# EAGLE schematic TUTUPA V2.5sch (EAGLE 7.3.0)

## Sheet 1 of 2
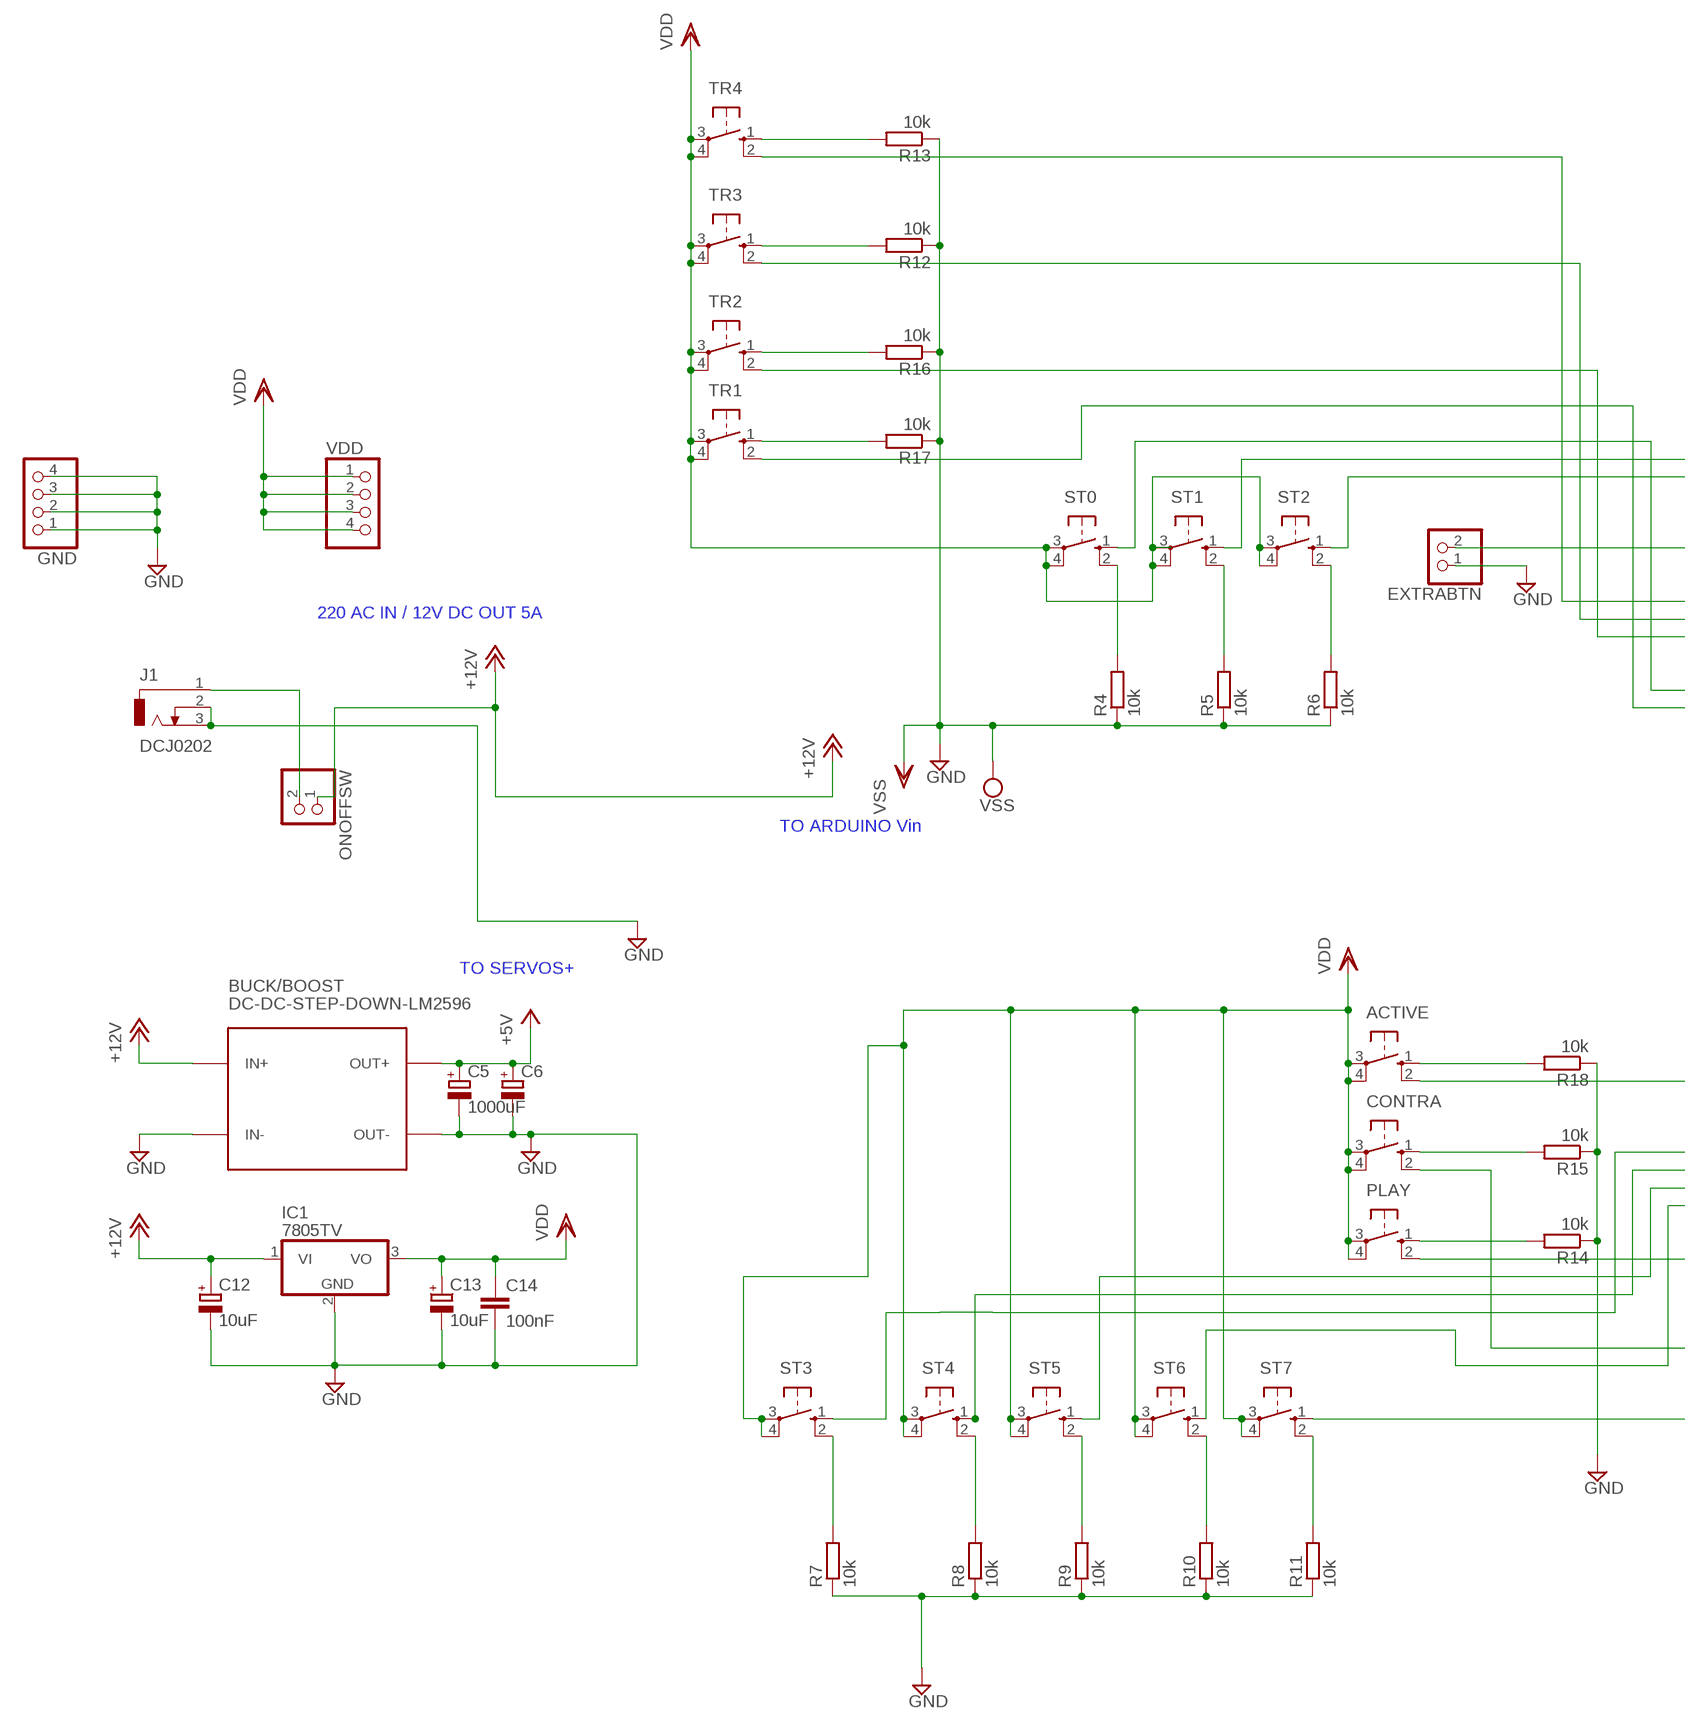
[diagram p0: schematic, sheet 1, part 1 of 2]
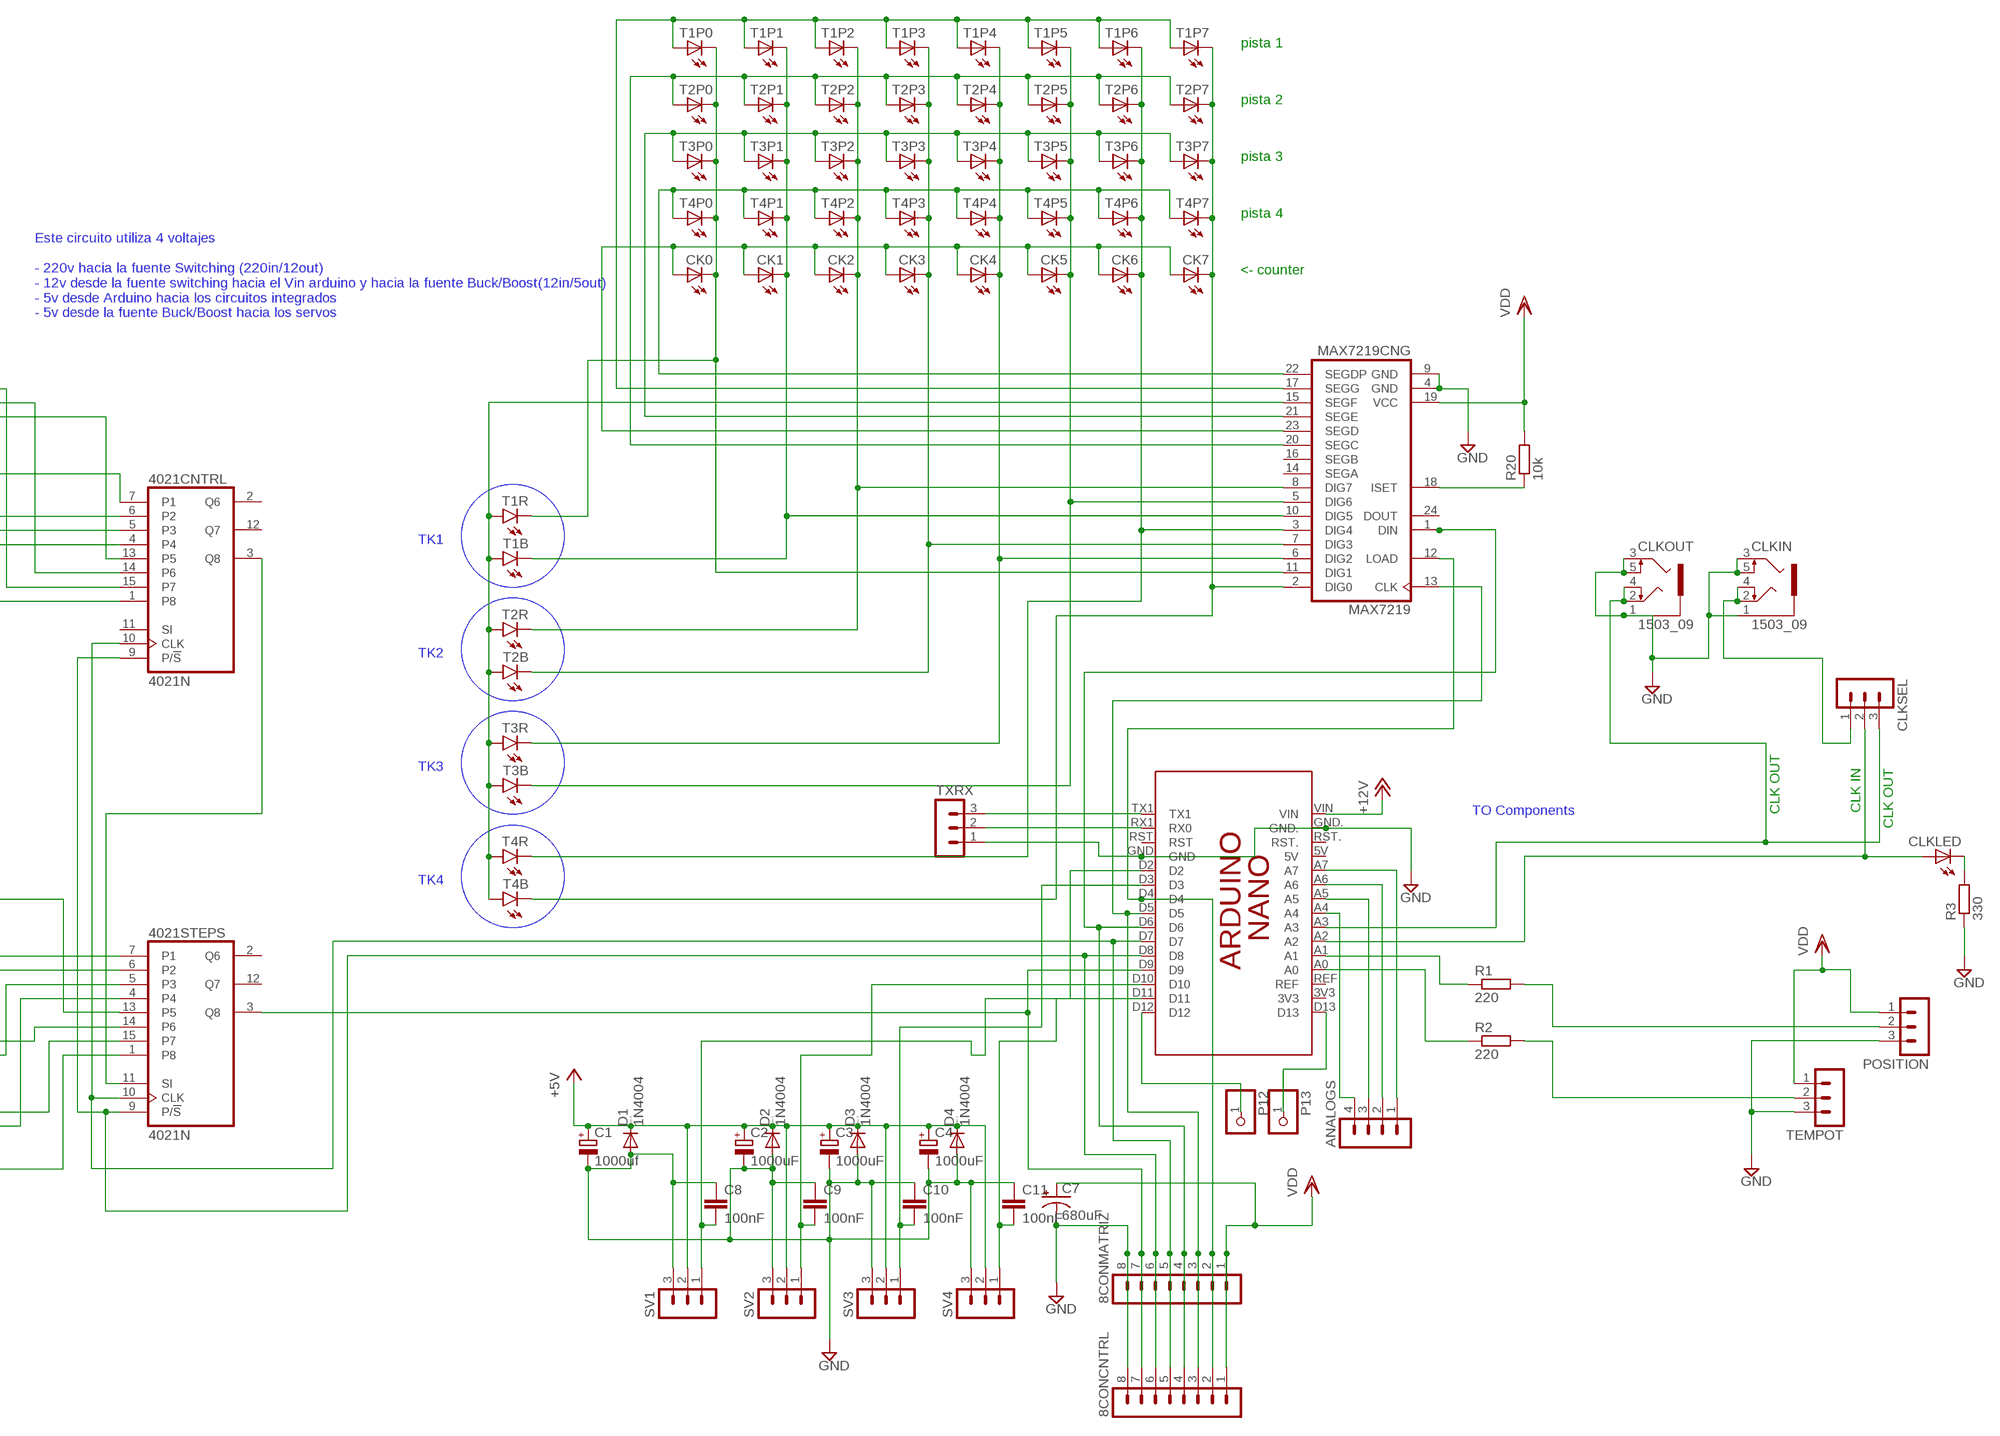
[diagram p1: schematic, sheet 1, part 2 of 2]

### Parts
8CONCNTRL  MA08-1W  [MA08-1W]
8CONMATRIZ  MA08-1W  [MA08-1W]
4021CNTRL  4021N  [DIL16]
4021STEPS  4021N  [DIL16]
ACTIVE  10-XX  [B3F-10XX]
ANALOGS  MA04-1  [MA04-1]
BUCK/BOOST  DC-DC-STEP-DOWN-LM2596  [DC-DC-STEP-DOWN-LM2596]
C1  1000uf  CPOL-EUE5-13  [E5-13]
C2  1000uF  CPOL-EUE5-13  [E5-13]
C3  1000uF  CPOL-EUE5-13  [E5-13]
C4  1000uF  CPOL-EUE5-13  [E5-13]
C5  1000uF  CPOL-EUE5-13  [E5-13]
C6  CPOL-EUE2.5-6  [E2,5-6]
C7  680uF  CPOL-USE5-10.5  [E5-10,5]
C8  100nF  C-EU050-024X044  [C050-024X044]
C9  100nF  C-EU050-024X044  [C050-024X044]
C10  100nF  C-EU050-024X044  [C050-024X044]
C11  100nF  C-EU050-024X044  [C050-024X044]
C12  10uF  CPOL-EUE1.8-4  [E1,8-4]
C13  10uF  CPOL-EUE1.8-4  [E1,8-4]
C14  100nF  C-EU050-024X044  [C050-024X044]
CK0  LED5MM  [LED5MM]
CK1  LED5MM  [LED5MM]
CK2  LED5MM  [LED5MM]
CK3  LED5MM  [LED5MM]
CK4  LED5MM  [LED5MM]
CK5  LED5MM  [LED5MM]
CK6  LED5MM  [LED5MM]
CK7  LED5MM  [LED5MM]
CLKIN  1503_09  [1503_09]
CLKLED  LED5MM  [LED5MM]
CLKOUT  1503_09  [1503_09]
CLKSEL  MA03-1  [MA03-1]
CONTRA  10-XX  [B3F-10XX]
D1  1N4004  [DO41-10]
D2  1N4004  [DO41-10]
D3  1N4004  [DO41-10]
D4  1N4004  [DO41-10]
EXTRABTN  PINHD-1X2  [1X02]
GND  PINHD-1X4  [1X04]
IC1  7805TV  [TO220V]
J1  DCJ0202  [DCJ0202]
MAX7219  MAX7219CNG  [DIL24-3]
ONOFFSW  PINHD-1X2  [1X02]
P12  PINHD-1X1  [1X01]
P13  PINHD-1X1  [1X01]
PCB1  ARDUINO_NANO  [ARDUINO_NANO]
PLAY  10-XX  [B3F-10XX]
POSITION  MA03-1  [MA03-1]
R1  220  R-EU_0204/7  [0204/7]
R2  220  R-EU_0204/7  [0204/7]
R3  330  R-EU_0204/7  [0204/7]
R4  10k  R-EU_0207/10  [0207/10]
R5  10k  R-EU_0207/10  [0207/10]
R6  10k  R-EU_0207/10  [0207/10]
R7  10k  R-EU_0207/10  [0207/10]
R8  10k  R-EU_0207/10  [0207/10]
R9  10k  R-EU_0207/10  [0207/10]
R10  10k  R-EU_0207/10  [0207/10]
R11  10k  R-EU_0207/10  [0207/10]
R12  10k  R-EU_0207/10  [0207/10]
R13  10k  R-EU_0207/10  [0207/10]
R14  10k  R-EU_0207/10  [0207/10]
R15  10k  R-EU_0207/10  [0207/10]
R16  10k  R-EU_0207/10  [0207/10]
R17  10k  R-EU_0207/10  [0207/10]
R18  10k  R-EU_0207/10  [0207/10]
R20  10k  R-EU_0207/10  [0207/10]
ST0  10-XX  [B3F-10XX]
ST1  10-XX  [B3F-10XX]
ST2  10-XX  [B3F-10XX]
ST3  10-XX  [B3F-10XX]
ST4  10-XX  [B3F-10XX]
ST5  10-XX  [B3F-10XX]
ST6  10-XX  [B3F-10XX]
ST7  10-XX  [B3F-10XX]
SV1  MA03-1  [MA03-1]
SV2  MA03-1  [MA03-1]
SV3  MA03-1  [MA03-1]
SV4  MA03-1  [MA03-1]
T1B  LED3MM  [LED3MM]
T1P0  LED5MM  [LED5MM]
T1P1  LED5MM  [LED5MM]
T1P2  LED5MM  [LED5MM]
T1P3  LED5MM  [LED5MM]
T1P4  LED5MM  [LED5MM]
T1P5  LED5MM  [LED5MM]
T1P6  LED5MM  [LED5MM]
T1P7  LED5MM  [LED5MM]
T1R  LED3MM  [LED3MM]
T2B  LED3MM  [LED3MM]
T2P0  LED5MM  [LED5MM]
T2P1  LED5MM  [LED5MM]
T2P2  LED5MM  [LED5MM]
T2P3  LED5MM  [LED5MM]
T2P4  LED5MM  [LED5MM]
T2P5  LED5MM  [LED5MM]
T2P6  LED5MM  [LED5MM]
T2P7  LED5MM  [LED5MM]
T2R  LED3MM  [LED3MM]
T3B  LED3MM  [LED3MM]
T3P0  LED5MM  [LED5MM]
T3P1  LED5MM  [LED5MM]
T3P2  LED5MM  [LED5MM]
T3P3  LED5MM  [LED5MM]
T3P4  LED5MM  [LED5MM]
T3P5  LED5MM  [LED5MM]
T3P6  LED5MM  [LED5MM]
T3P7  LED5MM  [LED5MM]
T3R  LED3MM  [LED3MM]
T4B  LED3MM  [LED3MM]
T4P0  LED5MM  [LED5MM]
T4P1  LED5MM  [LED5MM]
T4P2  LED5MM  [LED5MM]
T4P3  LED5MM  [LED5MM]
T4P4  LED5MM  [LED5MM]
T4P5  LED5MM  [LED5MM]
T4P6  LED5MM  [LED5MM]
T4P7  LED5MM  [LED5MM]
T4R  LED3MM  [LED3MM]
TEMPOT  MA03-1  [MA03-1]
TR1  10-XX  [B3F-10XX]
TR2  10-XX  [B3F-10XX]
TR3  10-XX  [B3F-10XX]
TR4  10-XX  [B3F-10XX]
TXRX  MA03-1  [MA03-1]
VDD  PINHD-1X4  [1X04]

### Nets
+5V: BUCK/BOOST.OUT+ C1.+ C2.+ C3.+ C4.+ C5.+ C6.+ D1.C D2.C D3.C D4.C SV1.2 SV2.2 SV3.2 SV4.2
+12V: BUCK/BOOST.IN+ C12.+ IC1.1(VI) ONOFFSW.1 PCB1.VIN
CLKINARDUINO: CLKLED.A CLKSEL.2 PCB1.A2
CLKOUTARDUINO: CLKOUT.2 CLKOUT.4 CLKSEL.3 PCB1.A3
CONIN: CLKIN.2 CLKIN.4 CLKSEL.1
GND: 8CONCNTRL.8 8CONMATRIZ.8 BUCK/BOOST.IN- BUCK/BOOST.OUT- C1.- C2.- C3.- C4.- C5.- C6.- C7.- C8.1 C9.1 C10.1 C11.1 C12.- C13.- C14.2 CLKIN.1 CLKIN.3 CLKIN.5 CLKOUT.1 CLKOUT.3 CLKOUT.5 D1.A D2.A D3.A D4.A EXTRABTN.1 GND.1 GND.2 GND.3 GND.4 IC1.2(GND) J1.2 J1.3 MAX7219.4(GND) MAX7219.9(GND) PCB1.GND PCB1.GND. POSITION.3 R3.1 R4.1 R5.1 R6.1 R7.1 R8.1 R9.1 R10.1 R11.1 R12.1 R13.1 R14.1 R15.1 R16.1 R17.1 R18.1 SV1.3 SV2.3 SV3.3 SV4.3 TEMPOT.3 TXRX.1 ; supply symbol labelled VSS
N$2: 4021CNTRL.14(P6) ST1.1(S)
N$3: ANALOGS.3 PCB1.A5
N$4: ANALOGS.2 PCB1.A6
N$5: ANALOGS.1 PCB1.A7
N$6: 4021CNTRL.13(P5) ST2.1(S)
N$7: 4021CNTRL.7(P1) EXTRABTN.2
N$8: R8.2 ST4.2(S1)
N$9: 4021STEPS.1(P8) ST7.1(S)
N$10: R17.2 TR1.1(S)
N$12: 4021CNTRL.15(P7) ST0.1(S)
N$13: 4021CNTRL.1(P8) TR1.2(S1)
N$14: 4021CNTRL.4 TR2.2(S1)
N$15: MAX7219.15(SEGF) T1B.A T1R.A T2B.A T2R.A T3B.A T3R.A T4B.A T4R.A
N$16: 4021CNTRL.5(P3) TR3.2(S1)
N$17: CONTRA.1(S) R15.2
N$18: 4021STEPS.14(P6) PLAY.2(S1)
N$19: 4021STEPS.6(P2) ST4.1(S)
N$20: 4021STEPS.5(P3) ST5.1(S)
N$21: 4021CNTRL.6(P2) TR4.2(S1)
N$25: PLAY.1(S) R14.2
N$26: R4.2 ST0.2(S1)
N$27: R5.2 ST1.2(S1)
N$28: R6.2 ST2.2(S1)
N$29: R7.2 ST3.2(S1)
N$30: 4021STEPS.7(P1) ST3.1(S)
N$31: R9.2 ST5.2(S1)
N$32: R10.2 ST6.2(S1)
N$33: R11.2 ST7.2(S1)
N$34: R13.2 TR4.1(S)
N$35: R12.2 TR3.1(S)
N$36: R16.2 TR2.1(S)
N$39: 4021STEPS.4 ST6.1(S)
N$40: 4021STEPS.15(P7) CONTRA.2(S1)
N$41: 4021STEPS.13(P5) ACTIVE.2(S1)
N$53: ACTIVE.1(S) R18.2
N$56: 4021CNTRL.3(Q8) 4021STEPS.11(SI)
N$57: 8CONCNTRL.5 8CONMATRIZ.5 4021CNTRL.10(CLK) 4021STEPS.10(CLK) PCB1.D7
N$58: 8CONCNTRL.6 8CONMATRIZ.6 4021CNTRL.9(P/!S) 4021STEPS.9(P/!S) PCB1.D8
N$59: 8CONCNTRL.3 8CONMATRIZ.3 MAX7219.13(CLK) PCB1.D5
N$60: 8CONCNTRL.4 8CONMATRIZ.4 MAX7219.1(DIN) PCB1.D6
N$63: 8CONCNTRL.7 8CONMATRIZ.7 4021STEPS.3(Q8) PCB1.D9
N$64: 8CONCNTRL.2 8CONMATRIZ.2 MAX7219.12(LOAD) PCB1.D4
N$66: MAX7219.18(ISET) R20.1
N$68: CK0.A CK1.A CK2.A CK3.A CK4.A CK5.A CK6.A CK7.A MAX7219.23(SEGD)
N$69: R2.2 TEMPOT.2
N$70: POSITION.2 R1.2
N$71: ANALOGS.4 PCB1.A4
N$72: J1.1 ONOFFSW.2
N$76: PCB1.A1 R1.1
N$77: PCB1.A0 R2.1
N$78: MAX7219.21(SEGE) T3P0.A T3P1.A T3P2.A T3P3.A T3P4.A T3P5.A T3P6.A T3P7.A
N$79: MAX7219.22(SEGDP) T4P0.A T4P1.A T4P2.A T4P3.A T4P4.A T4P5.A T4P6.A T4P7.A
N$81: CK0.K(C) MAX7219.11(DIG1) T1P0.K(C) T1R.K(C) T2P0.K(C) T3P0.K(C) T4P0.K(C)
N$82: CK1.K(C) MAX7219.10(DIG5) T1B.K(C) T1P1.K(C) T2P1.K(C) T3P1.K(C) T4P1.K(C)
N$83: CK2.K(C) MAX7219.8(DIG7) T1P2.K(C) T2P2.K(C) T2R.K(C) T3P2.K(C) T4P2.K(C)
N$84: CK3.K(C) MAX7219.7(DIG3) T1P3.K(C) T2B.K(C) T2P3.K(C) T3P3.K(C) T4P3.K(C)
N$85: CK4.K(C) MAX7219.6(DIG2) T1P4.K(C) T2P4.K(C) T3P4.K(C) T3R.K(C) T4P4.K(C)
N$86: CK5.K(C) MAX7219.5(DIG6) T1P5.K(C) T2P5.K(C) T3B.K(C) T3P5.K(C) T4P5.K(C)
N$87: CK6.K(C) MAX7219.3(DIG4) T1P6.K(C) T2P6.K(C) T3P6.K(C) T4P6.K(C) T4R.K(C)
N$88: CK7.K(C) MAX7219.2(DIG0) T1P7.K(C) T2P7.K(C) T3P7.K(C) T4B.K(C) T4P7.K(C)
N$100: MAX7219.17(SEGG) T1P0.A T1P1.A T1P2.A T1P3.A T1P4.A T1P5.A T1P6.A T1P7.A
N$101: MAX7219.20(SEGC) T2P0.A T2P1.A T2P2.A T2P3.A T2P4.A T2P5.A T2P6.A T2P7.A
N$142: PCB1.TX1 TXRX.3
N$143: PCB1.RX1(RX0) TXRX.2
N$154: CLKLED.K(C) R3.2
N$155: P12.1 PCB1.D12
N$156: P13.1 PCB1.D13
N$158: C8.2 PCB1.D11 SV1.1
N$161: C9.2 PCB1.D10 SV2.1
N$164: C10.2 PCB1.D3 SV3.1
N$167: C11.2 PCB1.D2 SV4.1
VDD: 8CONCNTRL.1 8CONMATRIZ.1 ACTIVE.3(P) ACTIVE.4(P1) C7.+ C13.+ C14.1 CONTRA.3(P) CONTRA.4(P1) IC1.3(VO) MAX7219.19(VCC) PLAY.3(P) PLAY.4(P1) POSITION.1 R20.2 ST0.3(P) ST0.4(P1) ST1.3(P) ST1.4(P1) ST2.3(P) ST2.4(P1) ST3.3(P) ST3.4(P1) ST4.3(P) ST4.4(P1) ST5.3(P) ST5.4(P1) ST6.3(P) ST6.4(P1) ST7.3(P) ST7.4(P1) TEMPOT.1 TR1.3(P) TR1.4(P1) TR2.3(P) TR2.4(P1) TR3.3(P) TR3.4(P1) TR4.3(P) TR4.4(P1) VDD.1 VDD.2 VDD.3 VDD.4
Unconnected: 4021CNTRL.2(Q6) 4021CNTRL.11(SI) 4021CNTRL.12(Q7) 4021STEPS.2(Q6) 4021STEPS.12(Q7) MAX7219.14(SEGA) MAX7219.16(SEGB) MAX7219.24(DOUT) PCB1.3V3 PCB1.5V PCB1.REF PCB1.RST PCB1.RST.

### Notes on the sheet
- pista 1
- pista 2
- pista 3
- pista 4
- <- counter
- Este circuito utiliza 4 voltajes
  
  - 220v hacia la fuente Switching (220in/12out)
  - 12v desde la fuente switching hacia el Vin arduino y hacia la fuente Buck/Boost(12in/5out)
  - 5v desde Arduino hacia los circuitos integrados
  - 5v desde la fuente Buck/Boost hacia los servos
- 220 AC IN / 12V DC OUT 5A
- TK1
- TK2
- TO ARDUINO Vin
- TK3
- TO SERVOS+ | TO Components | CLK OUT | CLK IN
- CLK OUT
- TK4

## Sheet 2 of 2

## Power pins joined to a net without a drawn wire
VDD: 4021CNTRL.16(VDD) 4021STEPS.16(VDD)
VSS: 4021CNTRL.8(VSS) 4021STEPS.8(VSS)

## Library data of the parts
8CONCNTRL 8CONMATRIZ = con-lstb:MA08-1W: PIN HEADER; OC_FARNELL: unknown; OC_NEWARK: unknown
4021CNTRL 4021STEPS = 40xx:4021: 8-bit static SHIFT REGISTER
ACTIVE CONTRA PLAY ST0 ST1-ST7 TR1-TR4 = switch-omron:10-XX: OMRON SWITCH; MPN: B3F-1000; OC_FARNELL: 176432; OC_NEWARK: 36M3542
ANALOGS = con-lstb:MA04-1: PIN HEADER; OC_FARNELL: unknown; OC_NEWARK: unknown
BUCK/BOOST = diy-modules:DC-DC-STEP-DOWN-LM2596: DC/DC Step-Down Regulator based on LM2596-ADJ chip
C1-C6 C12 C13 = resistor:CPOL-EU: POLARIZED CAPACITOR, European symbol
C7 = rcl:CPOL-US: POLARIZED CAPACITOR, American symbol
C8-C11 C14 = resistor:C-EU: CAPACITOR, European symbol
CK0 CK1-CK7 CLKLED T1P0 T1P1-T1P7 T2P0 T2P1-T2P7 T3P0 T3P1-T3P7 T4P0 T4P1-T4P7 = led:LED: LED OSRAM: - CHIPLED LG R971, LG N971, LY N971, LG Q971, LY Q971, LO R971, LY R971 LH N974, LH R974 LS Q976, LO Q976, LY Q976 LO Q996 - Hyper CHIPLED LW Q18S LB Q993, LB Q99A, LB R99A - SideLED LS A670, LO A670, LY A670, LG A670, LP A670 LB A673, LV A673, LT A673, LW A673 LH A674 LY A675 LS A676, LA A676, LO A676, LY A676, LW A676 LS A679, LY A679, LG A679 - Hyper Micro SIDELED® LS Y876, LA Y876, LO Y876, LY Y876 LT Y87S - SmartLED LW L88C, LW L88S LB L89C, LB L89S, LG L890 LS L89K, LO L89K, LY L89K LS L896, LA L896, LO L896, LY L896 - TOPLED LS T670, LO T670, LY T670, LG T670, LP T670 LSG T670, LSP T670, LSY T670, LOP T670, LYG T670 LG T671, LOG T671, LSG T671 LB T673, LV T673, LT T673, LW T673 LH T674 LS T676, LA T676, LO T676, LY T676, LB T676, LH T676, LSB T676, LW T676 LB T67C, LV T67C, LT T67C, LS T67K, LO T67K, LY T67K, LW E67C LS E67B, LA E67B, LO E67B, LY E67B, LB E67C, LV E67C, LT E67C LW T67C LS T679, LY T679, LG T679 LS T770, LO T770, LY T770, LG T770, LP T770 LB T773, LV T773, LT T773, LW T773 LH T774 LS E675, LA E675, LY E675, LS T675 LS T776, LA T776, LO T776, LY T776, LB T776 LHGB T686 LT T68C, LB T68C - Hyper Mini TOPLED® LB M676 - Mini TOPLED Santana® LG M470 LS M47K, LO M47K, LY M47K Source: http://www.osram.convergy.de LUXEON: - LUMILED® LXK2-PW12-R00, LXK2-PW12-S00, LXK2-PW14-U00, LXK2-PW14-V00 LXK2-PM12-R00, LXK2-PM12-S00, LXK2-PM14-U00 LXK2-PE12-Q00, LXK2-PE12-R00, LXK2-PE12-S00, LXK2-PE14-T00, LXK2-PE14-U00 LXK2-PB12-K00, LXK2-PB12-L00, LXK2-PB12-M00, LXK2-PB14-N00, LXK2-PB14-P00, LXK2-PB14-Q00 LXK2-PR12-L00, LXK2-PR12-M00, LXK2-PR14-Q00, LXK2-PR14-R00 LXK2-PD12-Q00, LXK2-PD12-R00, LXK2-PD12-S00 LXK2-PH12-R00, LXK2-PH12-S00 LXK2-PL12-P00, LXK2-PL12-Q00, LXK2-PL12-R00 Source: www.luxeon.com KINGBRIGHT: KA-3528ASYC Source: www.kingbright.com
CLKIN CLKOUT = con-lumberg:1503_09: Jack connectors according to JISC 6560, 3.5 mm Klinkeneinbaukupplung nach JISC 6560, 3,5 mm, 3-polig/ stereo, abgewinkelte Ausführung, mit 2 Öffnern und Lötaugen, für Leiterplatten Rückseitenmontage Source: http://www.lumberg.com/Produkte/PDFs/1503_09.pdf; OC_FARNELL: 1243244; OC_NEWARK: unknown
CLKSEL POSITION SV1-SV4 TEMPOT TXRX = con-lstb:MA03-1: PIN HEADER; OC_FARNELL: unknown; OC_NEWARK: unknown
D1-D4 = diode:1N4004: DIODE general purpose rectifier, 1 A
EXTRABTN ONOFFSW = pinhead:PINHD-1X2: PIN HEADER
GND VDD = pinhead:PINHD-1X4: PIN HEADER
IC1 = linear:78*: Positive VOLTAGE REGULATOR Source: http://cache.national.com/ds/LM/LM78L05.pdf http://www.fairchildsemi.com/ds/LM/LM7805.pdf
J1 = con-jack:DCJ0202: DC POWER JACK Source: DCJ0202.pdf; OC_FARNELL: unknown; OC_NEWARK: unknown
MAX7219 = maxim:MAX7219CNG: LED DISPLAY DRIVER; MF: MAXIM; MPN: MAX7219CNG; OC_FARNELL: 1523914; OC_NEWARK: 34C4018
P12 P13 = pinhead:PINHD-1X1: PIN HEADER
PCB1 = E14_Arduino_revB:ARDUINO_NANO: Device for representing an Arduino Nano board with a footprint in an EAGLE design. Created by Dave Young for Element14. More EAGLE documentation at: http://www.element14.com/community/community/knode/cadsoft_eagle
R1-R18 R20 = resistor:R-EU_: RESISTOR, European symbol
T1B T1R T2B T2R T3B T3R T4B T4R = SparkFun-LED:LED: LEDs Standard schematic elements and footprints for 5mm, 3mm, 1206, and 0603 sized LEDs. 5mm - Spark Fun Electronics SKU : COM-00529 (and others); PROD_ID: DIO-08794